# EAGLE design lymeshield_system (EAGLE 9.6.2)
APPROVED: MK; CONTACT: rluttrell@hatchpoint.com (901)605-3388; CREATED_DATE_TIME: 12/02/2022 07:42 AM; DESIGNED: RSL; FILENAME: lyme_shield_system.sch; REV: 2.3.x; SCHEMATIC_TITLE: LymeShieldSystem Main Board; SIZE: A1
Assembly variants: A

## Sheet 1 of 3: Title Page and Revisions
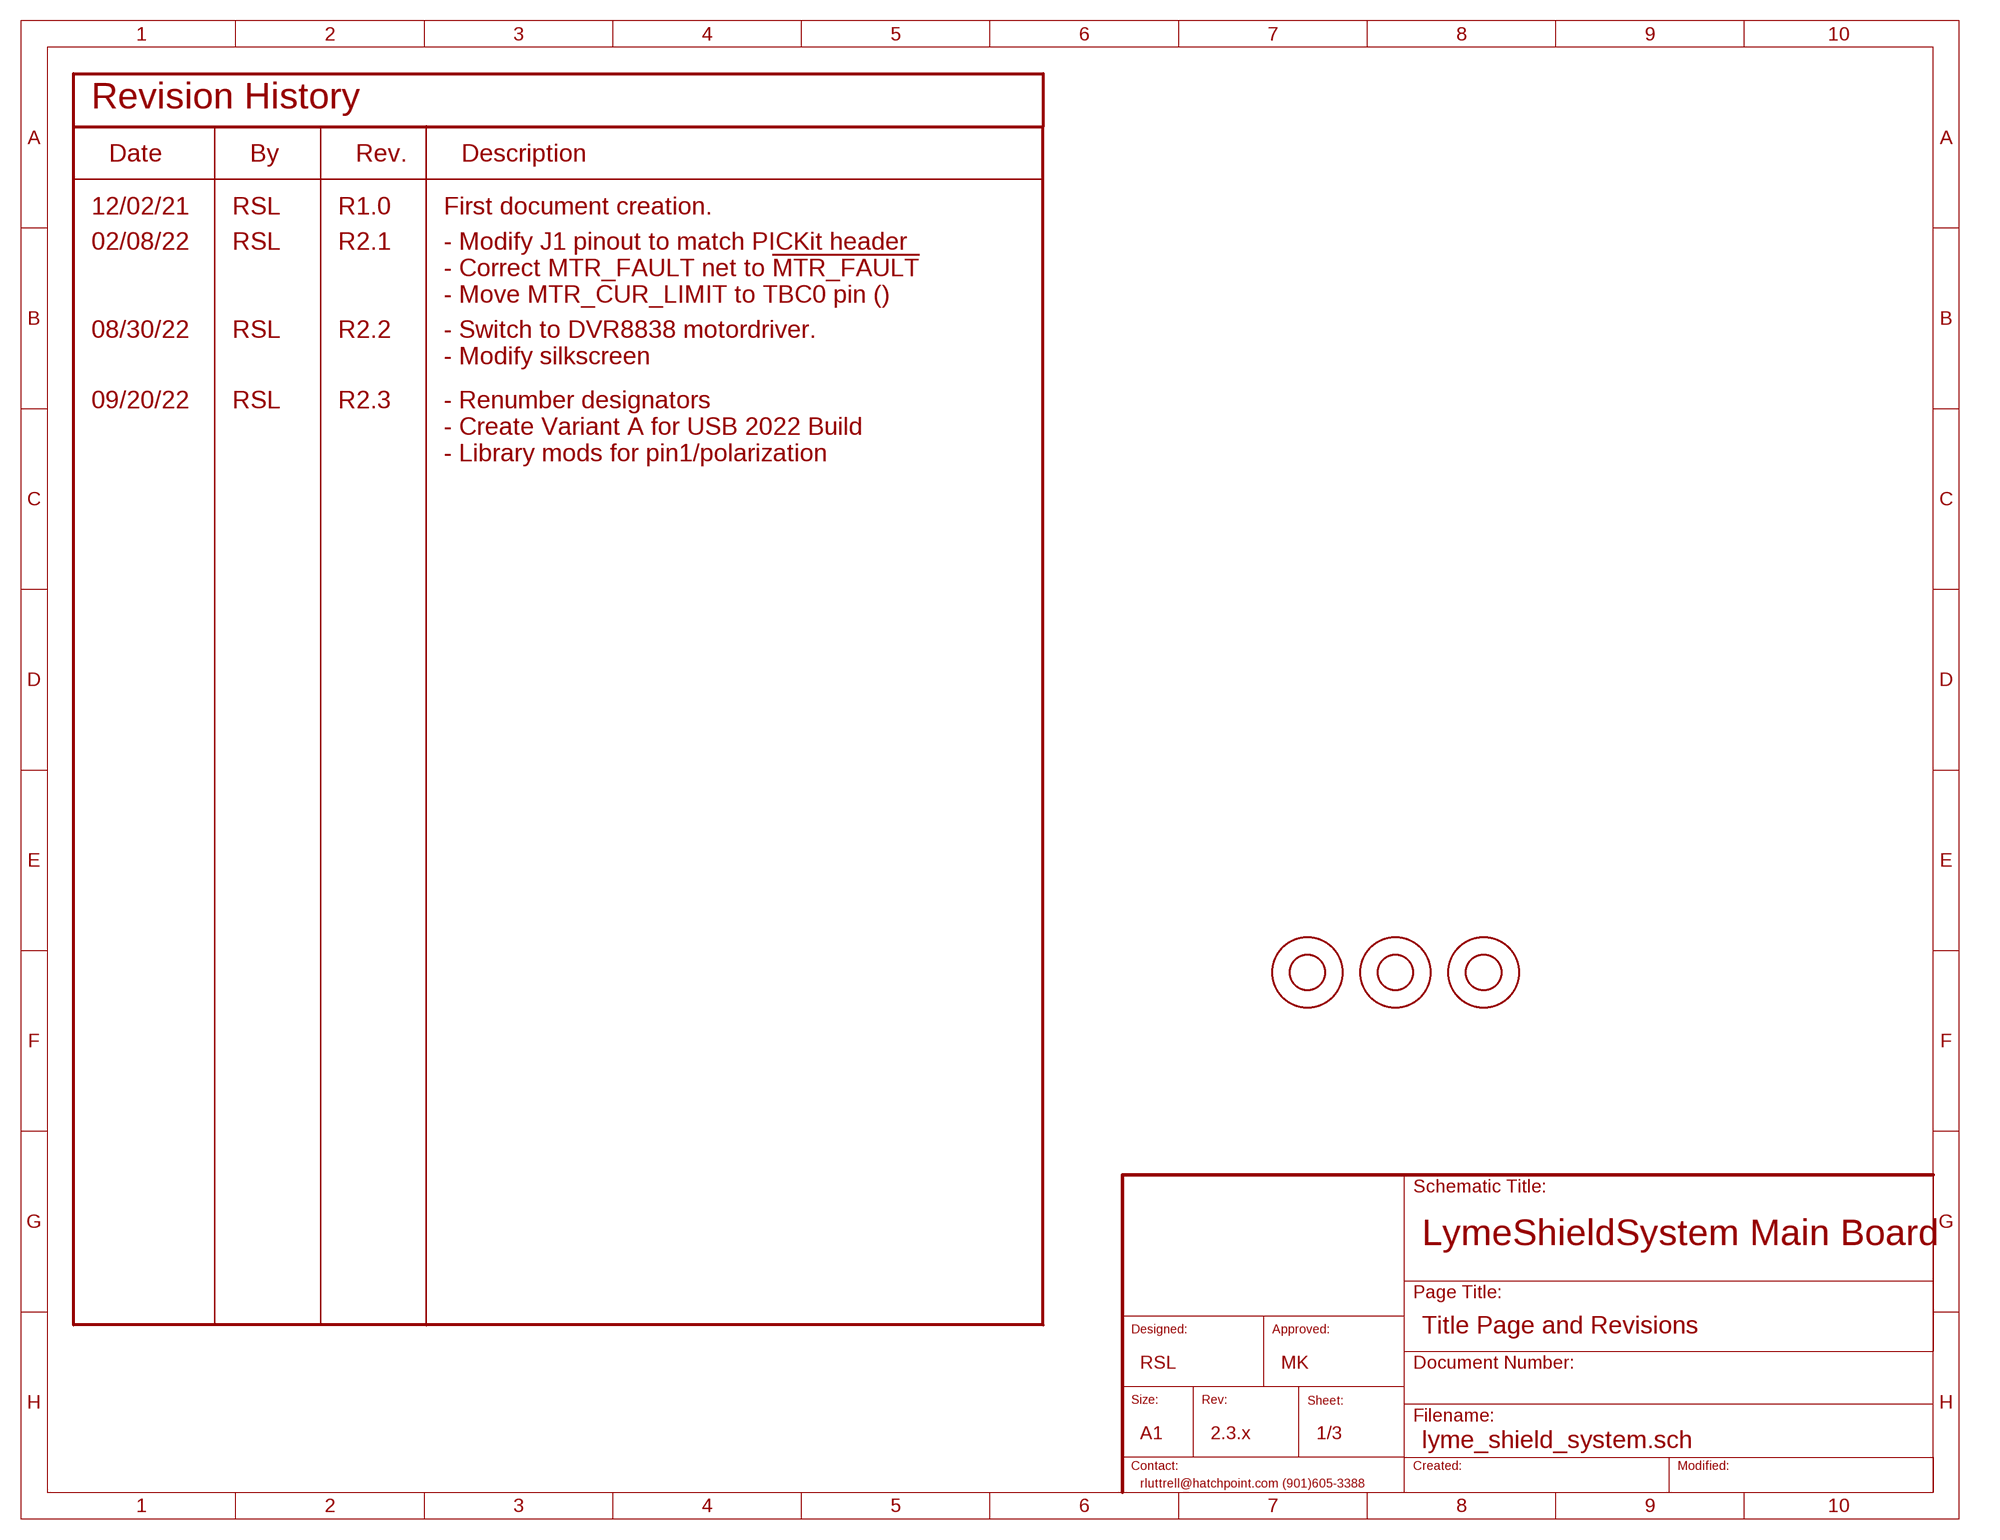
[diagram p0: schematic, sheet 1]

### Parts
FID1  FIDUCIAL_1MM_TOP_BOTTOM  [FIDUCIAL_1MM_TOP_BOTTOM]
FID2  FIDUCIAL_1MM_TOP_BOTTOM  [FIDUCIAL_1MM_TOP_BOTTOM]
FID3  FIDUCIAL_1MM_TOP_BOTTOM  [FIDUCIAL_1MM_TOP_BOTTOM]

### Notes on the sheet
- 12/02/21 | RSL | R1.0 | First document creation.
- - Modify J1 pinout to match PICKit header
  - Correct MTR_FAULT net to !MTR_FAULT
  - Move MTR_CUR_LIMIT to TBC0 pin ()
- 02/08/22 | RSL | R2.1
- - Switch to DVR8838 motordriver.
  - Modify silkscreen
- 08/30/22 | RSL | R2.2
- - Renumber designators
  - Create Variant A for USB 2022 Build
  - Library mods for pin1/polarization
- 09/20/22 | RSL | R2.3

## Sheet 2 of 3: Microcontroller and Peripherals
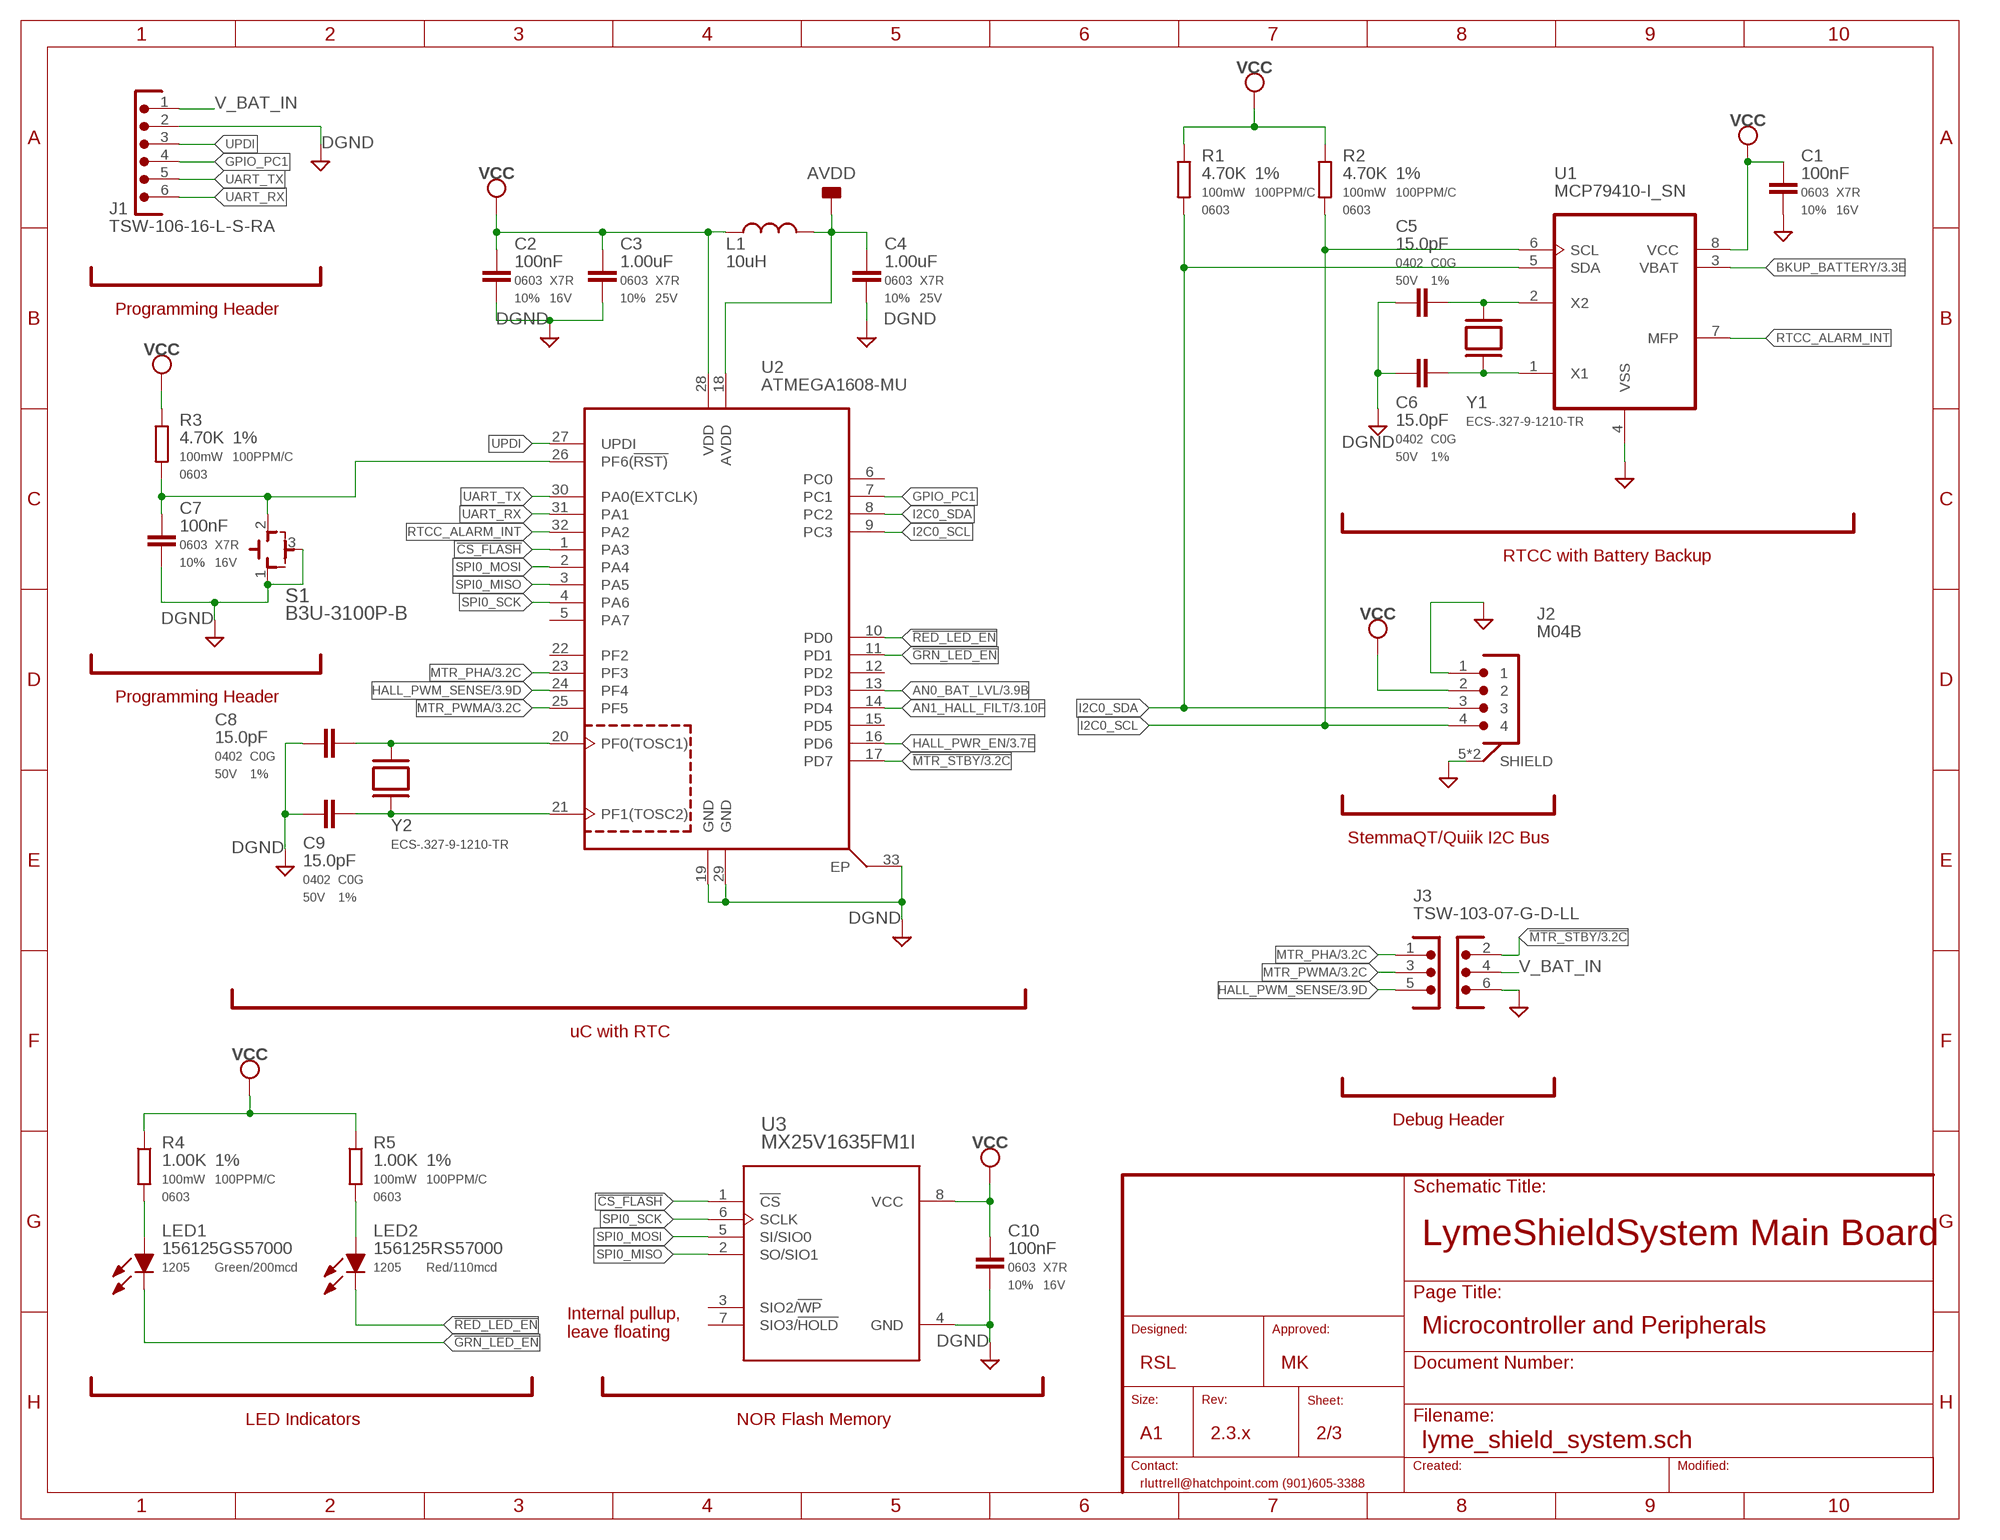
[diagram p1: schematic, sheet 2]

### Parts
C1  100nF  GCM188R71C104KA37J  [CAPC_0603_1608X90N]  (not fitted in variant A)
C2  100nF  GCM188R71C104KA37J  [CAPC_0603_1608X90N]
C3  1.00uF  GCM188R71E105KA64D  [CAPC_0603_1608X90N]
C4  1.00uF  GCM188R71E105KA64D  [CAPC_0603_1608X90N]
C5  15.0pF  GCM1555C1H150FA16D  [CAPC_0402_1005X55N]  (not fitted in variant A)
C6  15.0pF  GCM1555C1H150FA16D  [CAPC_0402_1005X55N]  (not fitted in variant A)
C7  100nF  GCM188R71C104KA37J  [CAPC_0603_1608X90N]
C8  15.0pF  GCM1555C1H150FA16D  [CAPC_0402_1005X55N]  (not fitted in variant A)
C9  15.0pF  GCM1555C1H150FA16D  [CAPC_0402_1005X55N]  (not fitted in variant A)
C10  100nF  GCM188R71C104KA37J  [CAPC_0603_1608X90N]  (not fitted in variant A)
J1  TSW-106-16-L-S-RA  [HDR-100MIL-1X6-THRU-RA]  (not fitted in variant A)
J2  M04B  [SM04B-SRSS-TB(LFSN)]  (not fitted in variant A)
J3  TSW-103-07-G-D-LL  [HDRV6W64P254_2X3_762X495X838P]  (not fitted in variant A)
L1  10uH  LB1608T100M  [INDC1608X90N]
LED1  156125GS57000  [LEDC3212X120N]  (not fitted in variant A)
LED2  156125RS57000  [LEDC3212X120N]
R1  4.70K  CRCW06034K70FKEA  [R0603K]  (not fitted in variant A)
R2  4.70K  CRCW06034K70FKEA  [R0603K]  (not fitted in variant A)
R3  4.70K  CRCW06034K70FKEA  [R0603K]
R4  1.00K  CRCW06031K00FKEAC  [R0603K]  (not fitted in variant A)
R5  1.00K  CRCW06031K00FKEAC  [R0603K]
S1  B3U-3100P-B  [B3U-3100P-B]  (not fitted in variant A)
U1  MCP79410-I_SN  [SOIC127P600X175-8N]  (not fitted in variant A)
U2  ATMEGA1608-MU  [QFN50P500X500X90-33N]
U3  MX25V1635FM1I  [SOIC127P600X175-8N]  (not fitted in variant A)
Y1  ECS-.327-9-1210-TR  [XTAL_ECS-.327-9-1210-TR]  (not fitted in variant A)
Y2  ECS-.327-9-1210-TR  [XTAL_ECS-.327-9-1210-TR]  (not fitted in variant A)

### Nets
!CS_FLASH: U2.1(PA3) U3.1(!CS)
!GRN_LED_EN: LED1.1(K) U2.11(PD1)
!MTR_STBY: J3.2 U2.17(PD7) ; also sheet 3
!RED_LED_EN: LED2.1(K) U2.10(PD0)
!RST: C7.1 R3.2 S1.2(NO) U2.26(PF6(!RST))
AN0_BAT_LVL: U2.13(PD3) ; also sheet 3
AN1_HALL_FILT: U2.14(PD4) ; also sheet 3
AVDD: C4.1 L1.2 U2.18(AVDD)
BKUP_BATTERY: U1.3(VBAT) ; also sheet 3
DGND [pwr]: C1.2 C2.2 C3.2 C4.2 C5.2 C6.2 C7.2 C8.2 C9.2 C10.2 J1.2 J2.1 J2.5(SHIELD) J2.6(SHIELD) J3.6 S1.1(COM) S1.3(COM1) U1.4(VSS) U2.19(GND) U2.29(GND) U2.33(EP) U3.4(GND) ; also sheet 3
GPIO_PC1: J1.4 U2.7(PC1)
HALL_PWM_SENSE: J3.5 U2.24(PF4) ; also sheet 3
HALL_PWR_EN: U2.16(PD6) ; also sheet 3
I2C0_SCL: J2.4 R2.2 U1.6(SCL) U2.9(PC3)
I2C0_SDA: J2.3 R1.2 U1.5(SDA) U2.8(PC2)
MTR_PHA: J3.1 U2.23(PF3) ; also sheet 3
MTR_PWMA: J3.3 U2.25(PF5) ; also sheet 3
N$1: C8.1 U2.20(PF0(TOSC1)) Y2.1
N$2: C5.1 U1.2(X2) Y1.1
N$8: LED1.2(A) R4.2
N$9: LED2.2(A) R5.2
N$16: C9.1 U2.21(PF1(TOSC2)) Y2.2
N$17: C6.1 U1.1(X1) Y1.2
RTCC_ALARM_INT: U1.7(MFP) U2.32(PA2)
SPI0_MISO: U2.3(PA5) U3.2(SO/SIO1)
SPI0_MOSI: U2.2(PA4) U3.5(SI/SIO0)
SPI0_SCK: U2.4(PA6) U3.6(SCLK)
UART_RX: J1.6 U2.31(PA1)
UART_TX: J1.5 U2.30(PA0(EXTCLK))
UPDI: J1.3 U2.27(UPDI)
V_BAT_IN [high_current]: J1.1 J3.4 ; also sheet 3
VCC [pwr]: C1.1 C2.1 C3.1 C10.1 J2.2 L1.1 R1.1 R2.1 R3.1 R4.1 R5.1 U1.8(VCC) U2.28(VDD) U3.8(VCC) ; also sheet 3
Unconnected: U2.5(PA7) U2.6(PC0) U2.12(PD2) U2.15(PD5) U2.22(PF2) U3.3(SIO2/!WP) U3.7(SIO3/!HOLD)

### Notes on the sheet
- Programming Header
- RTCC with Battery Backup
- Programming Header
- StemmaQT/Quiik I2C Bus
- uC with RTC
- Debug Header
- Internal pullup, 
  leave floating
- LED Indicators | NOR Flash Memory

## Sheet 3 of 3: Motor Driver and Position Sensor
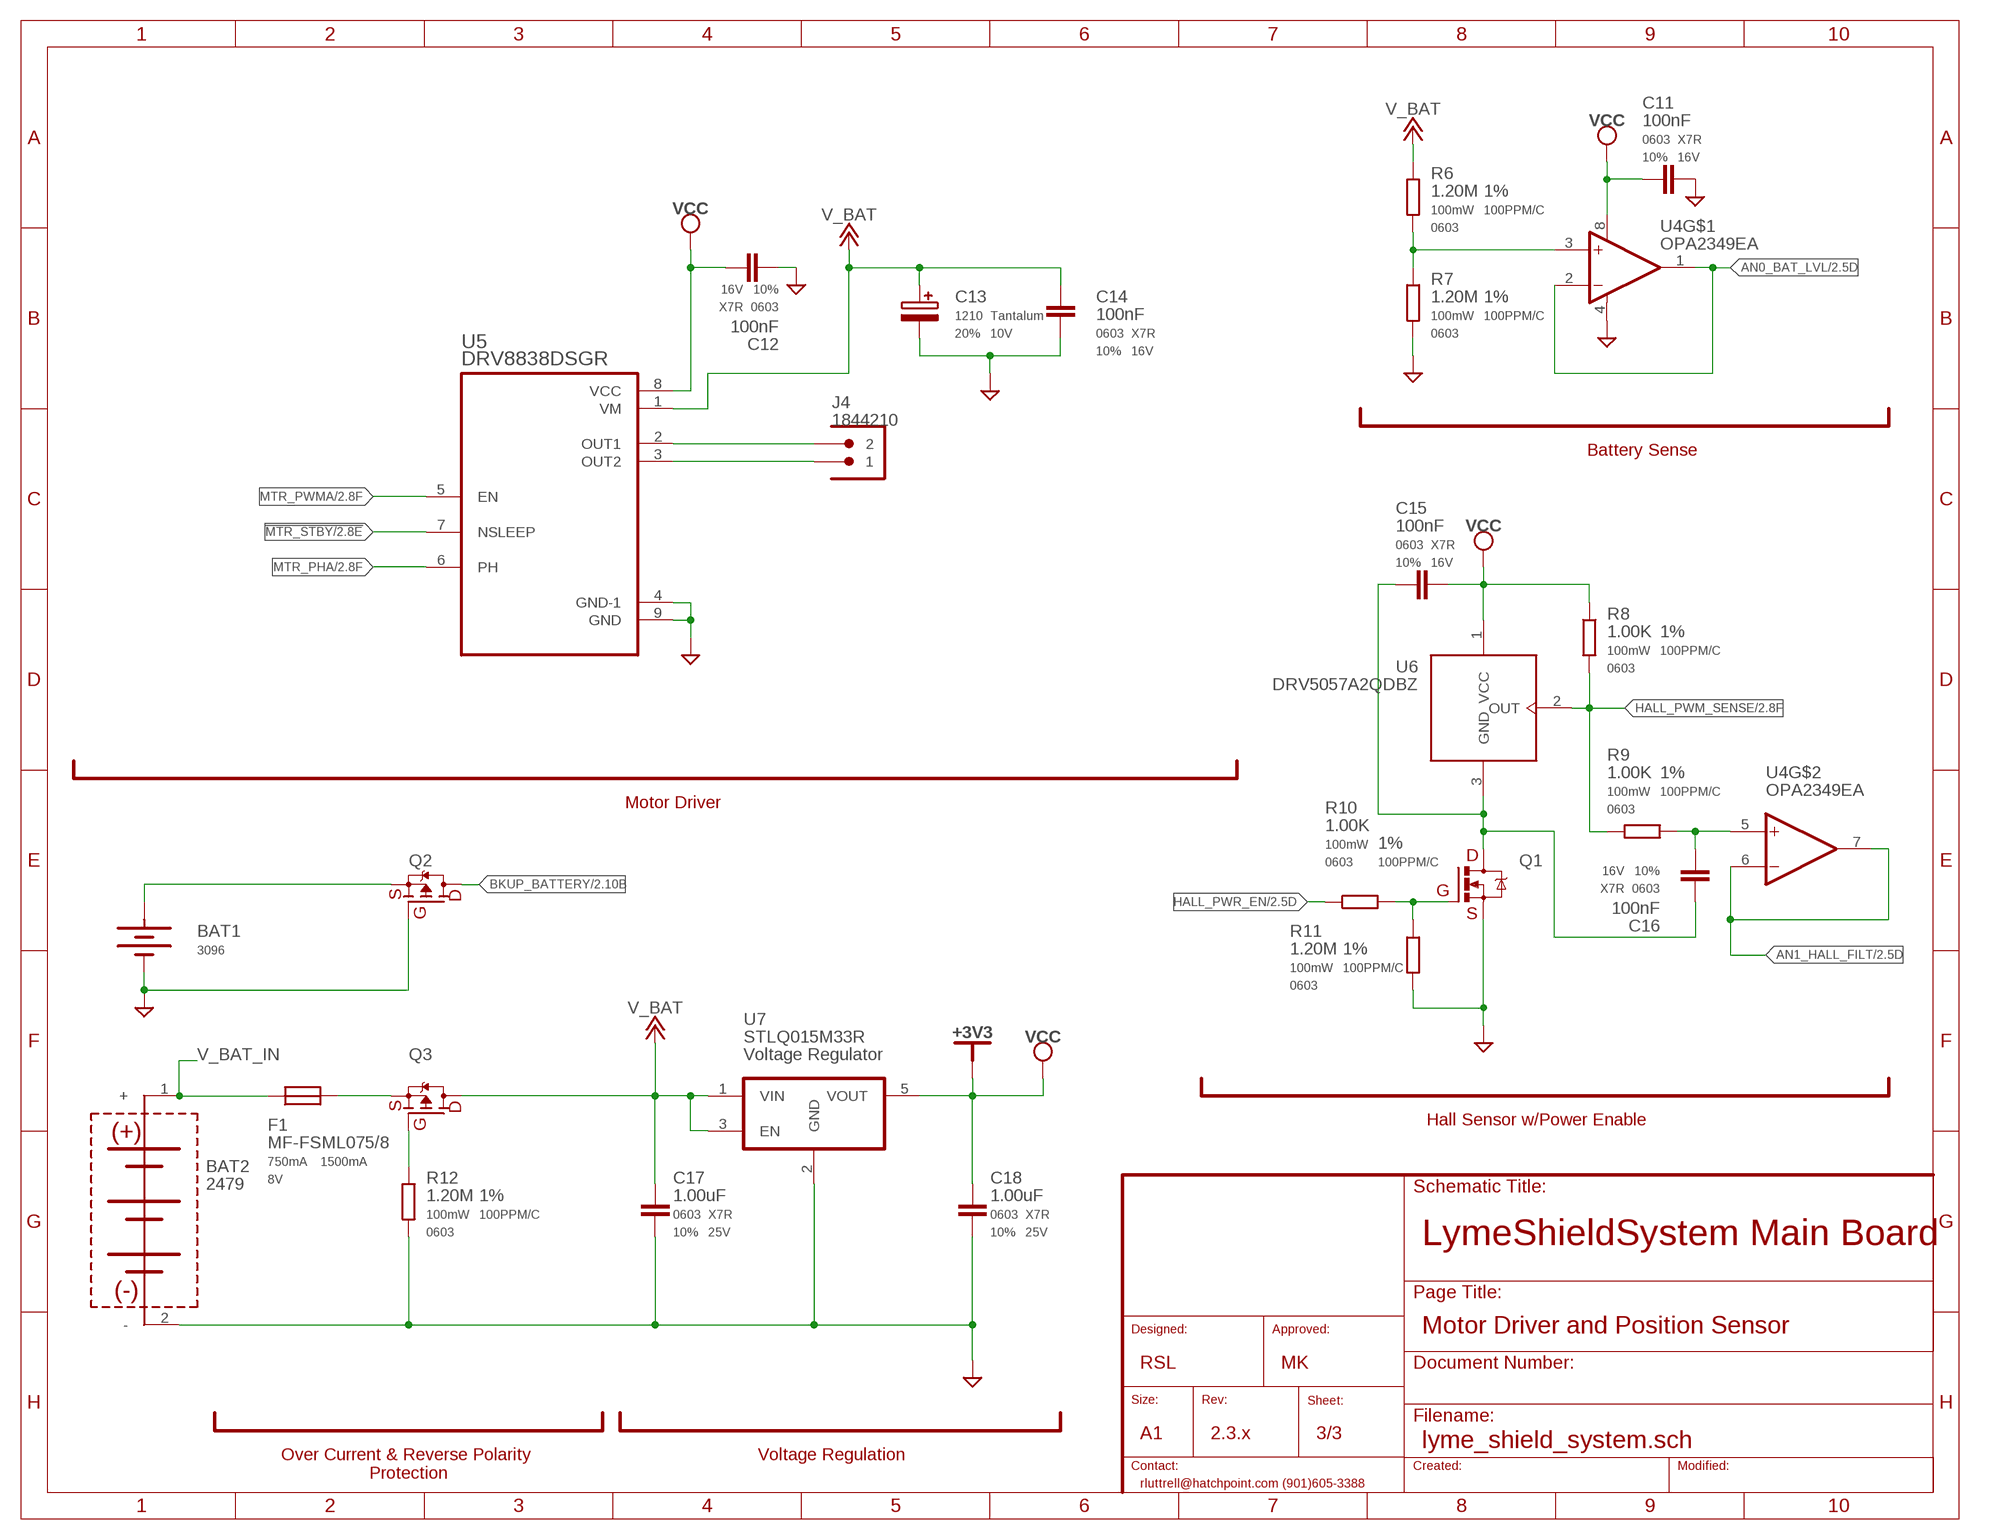
[diagram p2: schematic, sheet 3]

### Parts
BAT1  3096  [3096]  (not fitted in variant A)
BAT2  2479  [2479]
C11  100nF  GCM188R71C104KA37J  [CAPC_0603_1608X90N]
C12  100nF  GCM188R71C104KA37J  [CAPC_0603_1608X90N]
C13  TAJB226M010RNJ  [PCAPC_1210]
C14  100nF  GCM188R71C104KA37J  [CAPC_0603_1608X90N]
C15  100nF  GCM188R71C104KA37J  [CAPC_0603_1608X90N]
C16  100nF  GCM188R71C104KA37J  [CAPC_0603_1608X90N]
C17  1.00uF  GCM188R71E105KA64D  [CAPC_0603_1608X90N]
C18  1.00uF  GCM188R71E105KA64D  [CAPC_0603_1608X90N]
F1  MF-FSML075/8  [FUSC1608X70N]
J4  1844210  [1844210-2-3.50]  (not fitted in variant A)
Q1  FDN5632N-F085-FDN5632N_F085  [SOT-23]
Q2  PMOS_DMP2035U-7  [SOT-23]  (not fitted in variant A)
Q3  PMOS_DMP2035U-7  [SOT-23]
R6  1.20M  CRCW06031M20FKEA  [R0603K]
R7  1.20M  CRCW06031M20FKEA  [R0603K]
R8  1.00K  CRCW06031K00FKEAC  [R0603K]
R9  1.00K  CRCW06031K00FKEAC  [R0603K]
R10  1.00K  CRCW06031K00FKEAC  [R0603K]
R11  1.20M  CRCW06031M20FKEA  [R0603K]
R12  1.20M  CRCW06031M20FKEA  [R0603K]
U4  OPA2349EA  [SOT65P280X145-8N]
U5  DRV8838DSGR  [SON50P200X200X80-9N]
U6  DRV5057A2QDBZ  [SOT95P237X112-3N]
U7  STLQ015M33R  [SOT23-5L]

### Nets
!MTR_STBY: U5.7(NSLEEP) ; also sheet 2
AN0_BAT_LVL: U4.1(OUT) U4.2(-IN) ; also sheet 2
AN1_HALL_FILT: U4.6(-IN) U4.7(OUT) ; also sheet 2
BKUP_BATTERY: Q2.1(D) ; also sheet 2
DGND [pwr]: BAT1.1(-) BAT1.3(-) BAT2.2(-) C11.1 C12.2 C13.2(-) C14.2 C17.2 C18.2 Q1.2(S) Q2.3(G) R7.2 R11.2 R12.2 U4.4(V-) U5.4(GND-1) U5.9(GND) U7.2(GND) ; also sheet 2
HALL_PWM_SENSE: R8.2 R9.1 U6.2(OUT) ; also sheet 2
HALL_PWR_EN: R10.1 ; also sheet 2
MTR_PHA: U5.6(PH) ; also sheet 2
MTR_PWMA: U5.5(EN) ; also sheet 2
N$5: Q1.3(G) R10.2 R11.1
N$6: Q3.3(G) R12.1
N$7: BAT1.2(+) Q2.2(S)
N$10: R6.2 R7.1 U4.3(+IN)
N$14 [high_current]: F1.2 Q3.2(S)
N$20: C16.1 R9.2 U4.5(+IN)
N$23 [pwr]: C15.2 C16.2 Q1.1(D) U6.3(GND)
OUTA1 [high_current]: J4.P$2 U5.2(OUT1)
OUTA2 [high_current]: J4.P$1 U5.3(OUT2)
V_BAT [high_current]: C13.1(+) C14.1 C17.1 Q3.1(D) R6.1 U5.1(VM) U7.1(VIN) U7.3(EN)
V_BAT_IN [high_current]: BAT2.1(+) F1.1 ; also sheet 2
VCC [pwr]: C11.2 C12.1 C15.1 C18.1 R8.1 U4.8(V+) U5.8(VCC) U6.1(VCC) U7.5(VOUT) ; supply symbol labelled +3V3 ; also sheet 2

### Notes on the sheet
- Battery Sense
- Motor Driver
- Hall Sensor w/Power Enable
- Over Current & Reverse Polarity 
  Protection
- Voltage Regulation

## Library data of the parts
BAT1 = HatchPoint-Batteries:3096: Battery Contacts 2996 matte Tin Coin Cell Retainer Source: Datasheet <http://www.keyelco.com/product-pdf.cfm?p=768>; DESCRIPTION: Battery Contacts 2996 matte Tin Coin Cell Retainer; HEIGHT: 5.97mm; MANUFACTURER_NAME: Keystone Electronics; MANUFACTURER_PART_NUMBER: 3096; MOUSER_PART_NUMBER: 534-3096; MOUSER_PRICE-STOCK: https://www.mouser.co.uk/ProductDetail/Keystone-Electronics/3096?qs=BMR1h6ig6pBmf86jRreoMg%3D%3D
BAT2 = HatchPoint-Batteries:2479: KEYSTONE - 2479 - BATTERY HOLDER, AAA, 3WAY Source: Datasheet <http://www.keyelco.com/product-pdf.cfm?p=1041>; DESCRIPTION: KEYSTONE - 2479 - BATTERY HOLDER, AAA, 3WAY; HEIGHT: 13mm; MANUFACTURER_NAME: Keystone Electronics; MANUFACTURER_PART_NUMBER: 2479; MOUSER_PART_NUMBER: 534-2479; MOUSER_PRICE-STOCK: https://www.mouser.co.uk/ProductDetail/Keystone-Electronics/2479?qs=Q3RoVmURDomBPD85HfXZoA%3D%3D
C1 C2 C7 C10-C12 C14-C16 = HatchPoint-Capacitors:GCM?*: GCM Series Multilayer Ceramic Capacitors MLCC Murata; MANUFACTURER: Murata; PACKAGE: 0603; TOL: 10%; TYPE: X7R; VDC: 16V
C3 C4 C17 C18 = HatchPoint-Capacitors:GCM?*: GCM Series Multilayer Ceramic Capacitors MLCC Murata; MANUFACTURER: Murata; PACKAGE: 0603; TOL: 10%; TYPE: X7R; VDC: 25V
C5 C6 C8 C9 = HatchPoint-Capacitors:GCM?*: GCM Series Multilayer Ceramic Capacitors MLCC Murata; MANUFACTURER: Murata; PACKAGE: 0402; TOL: 1%; TYPE: C0G; VDC: 50V
C13 = HatchPoint-Capacitors:TAJ?*; DESCRIPTION: Tantalum Capcitor, 2.4Ohm ESR 1210; ESR: 2.4 Ohm; MANUFACTURER: AVX; PACKAGE: 1210; TOL: 20%; TYPE: Tantalum; VDC: 10V
F1 = HatchPoint-Bourns:MF-FSML?: Resettable Fuses - PPTC 8V 1.25A Source: Datasheet <https://www.mouser.com/datasheet/2/54/bourns_05032019_MF-FSML-X_datasheet-1591429.pdf>; DESCRIPTION: Poly Fuse; IHOLD: 750mA; ITRIP: 1500mA; VMAX: 8V
FID1-FID3 = HatchPoint:FIDUCIAL
J1 = HatchPoint-Samtec:TSW-106-16-L-S-RA
J2 = HatchPoint-JST:?M04B*: 4 way side entry SMT header,1mm pitch JST SH Series, 1mm Pitch 4 Way 1 Row Right Angle PCB Header, Solder Termination, 1A Source: Datasheet <http://docs-emea.rs-online.com/webdocs/05b0/0900766b805b098a.pdf>; DESCRIPTION: 4 way side entry SMT header,1mm pitch JST SH Series, 1mm Pitch 4 Way 1 Row Right Angle PCB Header, Solder Termination, 1A; HEIGHT: mm; MANUFACTURER_NAME: JST (JAPAN SOLDERLESS TERMINALS); MANUFACTURER_PART_NUMBER: SM04B-SRSS-TB(LFSN)
J3 = HatchPoint-Samtec:TSW-103-07-G-D-LL: CONN HEADER 6 POS .100" Source: Datasheet <http://suddendocs.samtec.com/catalog_english/tsw_th.pdf>; ARROW_PART_NUMBER: TSW-103-07-G-D-LL; ARROW_PRICE-STOCK: https://www.arrow.com/en/products/tsw-103-07-g-d-ll/samtec?region=nac; DESCRIPTION: CONN HEADER 6 POS .100"; HEIGHT: 8.38mm; MANUFACTURER_NAME: SAMTEC; MANUFACTURER_PART_NUMBER: TSW-103-07-G-D-LL; MOUSER_PART_NUMBER: 200-TSW10307GDLL; MOUSER_PRICE-STOCK: https://www.mouser.co.uk/ProductDetail/Samtec/TSW-103-07-G-D-LL?qs=rU5fayqh%252BE3VkDqz1GA%2F6A%3D%3D
J4 = HatchPoint-PhoenixContact:1844210
L1 = HatchPoint-Inductors:LB1608T100M: Ind Chip Wirewound 10uH 20% 2.52MHz Ferrite 60mA 0603 T/R Check prices <https://pricing.snapeda.com/parts/LB1608T100M/Taiyo%20Yuden/view-part?ref=eda>; AVAILABILITY: Good; DESCRIPTION: 10µH Unshielded Wirewound Inductor 60mA 700mOhm 0603 (1608 Metric); IDC: 60mA; MF: Taiyo Yuden; MP: LB1608T100M; PACKAGE: 0603; R: 700mOhm
LED1 = HatchPoint-Wurtz:156125: 3.9 V Green LED 1205 SMD, Wurth Elektronik WL-SMRD 156125GS57000 Source: Datasheet <https://docs.rs-online.com/0ef6/0900766b816634b7.pdf>; DESCRIPTION: Green/200mcd; MANUFACTURER_NAME: Wurth Electronics; PACKAGE: 1205
LED2 = HatchPoint-Wurtz:156125: 3.9 V Green LED 1205 SMD, Wurth Elektronik WL-SMRD 156125GS57000 Source: Datasheet <https://docs.rs-online.com/0ef6/0900766b816634b7.pdf>; DESCRIPTION: Red/110mcd; MANUFACTURER_NAME: Wurth Electronics; PACKAGE: 1205
Q1 = HatchPoint-Transistors:FDN5632N-F085: MOSFET Trans MOS N-Ch 60V 1.7A; DESCRIPTION: On Semi N-MOS 60V 1.7A 98mOhm MOSFET; MANUFACTURER: ON Semiconductor
Q2 Q3 = HatchPoint-Transistors:PMOS: MOSFET MOSFET P-CHANNEL SOT-23; MF: Diodes Incorporated; MP: DMP2035U-7; POPULATE: Y
R1-R12 = HatchPoint-Resistors:CRCW?*: Vishay/Dale SMD Resistor; MF: Vishay; PACKAGE: 0603; PWR_RATE: 100mW; TEMPCO: 100PPM/C; TOLERANCE: 1%; TYPE: Thick Film
S1 = HatchPoint-OMRON:B3U-3100*
U1 = HatchPoint-MicrochipTechnology:MCP79410-I_SN: I2C GP RTCC, 1Kb EE, 64B SRAM, ID Source: Datasheet <https://datasheet.datasheetarchive.com/originals/distributors/Datasheets-DGA3/278325.pdf>; ARROW_PART_NUMBER: MCP79410-I/SN; ARROW_PRICE-STOCK: https://www.arrow.com/en/products/mcp79410-isn/microchip-technology; DESCRIPTION: I2C GP RTCC, 1Kb EE, 64B SRAM, ID; HEIGHT: 1.75mm; MANUFACTURER_NAME: Microchip; MANUFACTURER_PART_NUMBER: MCP79410-I/SN; MOUSER_PART_NUMBER: 579-MCP79410-I/SN; MOUSER_PRICE-STOCK: https://www.mouser.co.uk/ProductDetail/Microchip-Technology/MCP79410-I-SN?qs=LU7oW20kJpNhp%252BQbxumdTQ%3D%3D
U2 = HatchPoint-MicrochipTechnology:ATMEGA1608: 8-bit Microcontrollers - MCU 20MHz, 16KB, SOIC Source: Datasheet <http://www.microchip.com/mymicrochip/filehandler.aspx?ddocname=en604845>; DESCRIPTION: 8-bit Microcontrollers - MCU 20MHz, 16KB, SOIC; HEIGHT: 0.9mm; MANUFACTURER_NAME: Microchip; MANUFACTURER_PART_NUMBER: ATMEGA1608-MU; MOUSER_PART_NUMBER: 556-ATMEGA1608-MU; MOUSER_PRICE-STOCK: https://www.mouser.co.uk/ProductDetail/Microchip-Technology-Atmel/ATMEGA1608-MU?qs=P1JMDcb91o6TsqFiAm0Zmw%3D%3D
U3 = HatchPoint-Macronix:MX25V*?; DENSITY: 16Mb; DESCRIPTION: Macronix 16Mb (2Mx8) NOR Flash 8-SOIC; MANUFACTURER: Macronix
U4 = HatchPoint-OPAMPs:OPA2349: 1uA, Rail-to-Rail, CMOS Operational Amplifiers Source: Datasheet <http://www.ti.com/lit/gpn/OPA2349>; ARROW_PART_NUMBER: OPA2349EA/3K; ARROW_PRICE-STOCK: https://www.arrow.com/en/products/opa2349ea3k/texas-instruments?region=nac; DESCRIPTION: 1uA, Rail-to-Rail, CMOS Operational Amplifiers; HEIGHT: 1.45mm; MANUFACTURER_NAME: Texas Instruments; MANUFACTURER_PART_NUMBER: OPA2349EA/3K; MOUSER_PART_NUMBER: 595-OPA2349EA/3K; MOUSER_PRICE-STOCK: https://www.mouser.co.uk/ProductDetail/Texas-Instruments/OPA2349EA-3K?qs=7nS3%252BbEUL6sMpP9ngN4Iww%3D%3D
U5 = HatchPoint-MotionControl:DRV8838DSGR: Check availability <https://pricing.snapeda.com/parts/DRV8838DSGT/Texas%20Instruments/view-part?ref=eda>; AVAILABILITY: In Stock; DESCRIPTION: 11-V, 1.8-A H-bridge motor driver with phase/enable control; MF: Texas Instruments; MP: DRV8838DSGT; PACKAGE: WSON-8 Texas Instruments; PRICE: None; PURCHASE-URL: https://pricing.snapeda.com/search/part/DRV8838DSGT/?ref=eda
U6 = HatchPoint-TI:DRV5057: High voltage (up to 38V), linear hall effect sensor Source: Datasheet <https://www.ti.com/lit/gpn/DRV5053>
U7 = HatchPoint-ST:STLQ015M: LDO Voltage Regulators 150 mA - ultra low quiescent current linear voltage regulator; DESC: Voltage Regulator; MF: STM; MP: STLQ015M33R; VOLTAGE: 3.3V
Y1 Y2 = HatchPoint-ABRACON:ECS-.327-9-1210-TR: Crystal 2-SMD, No Lead; CL: 9.0pF; DESCRIPTION: 32.768kHz ±20ppm Crystal 9pF 90 kOhms 2-SMD, No Lead; DIGI-KEY_PART_NUMBER: XC2283CT-ND; MF: ECS Inc.; MP: ECS-.327-9-1210-TR; PACKAGE: SMD-2 ECS International; PURCHASE-URL: https://pricing.snapeda.com/search/part/ECS-.327-9-1210-TR/?ref=eda; TOL: 20ppm

## Net classes
0 default: width 0.203 mm, drill 0.356 mm, clearance 0.152 mm
1 pwr: width 0.305 mm, drill 0.356 mm, clearance 0.152 mm to class 0, clearance 0.152 mm
2 high_current: width 0.635 mm, drill 0.356 mm, clearance 0.152 mm to class 0, clearance 0.152 mm to class 1, clearance 0.152 mm

## Board
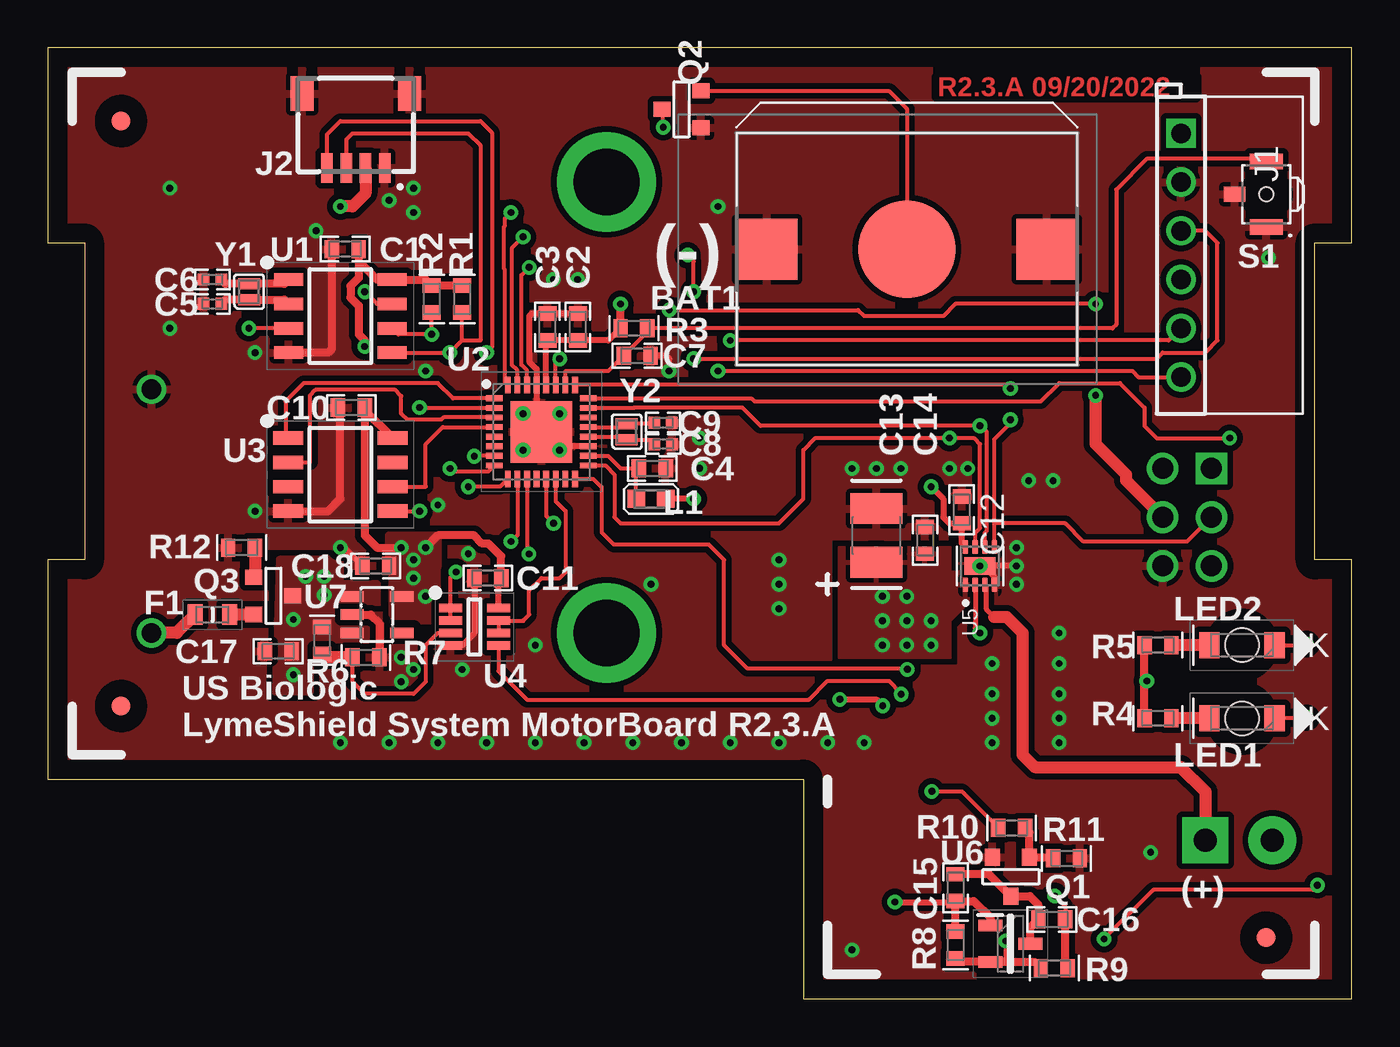
[diagram p3: board, top side]
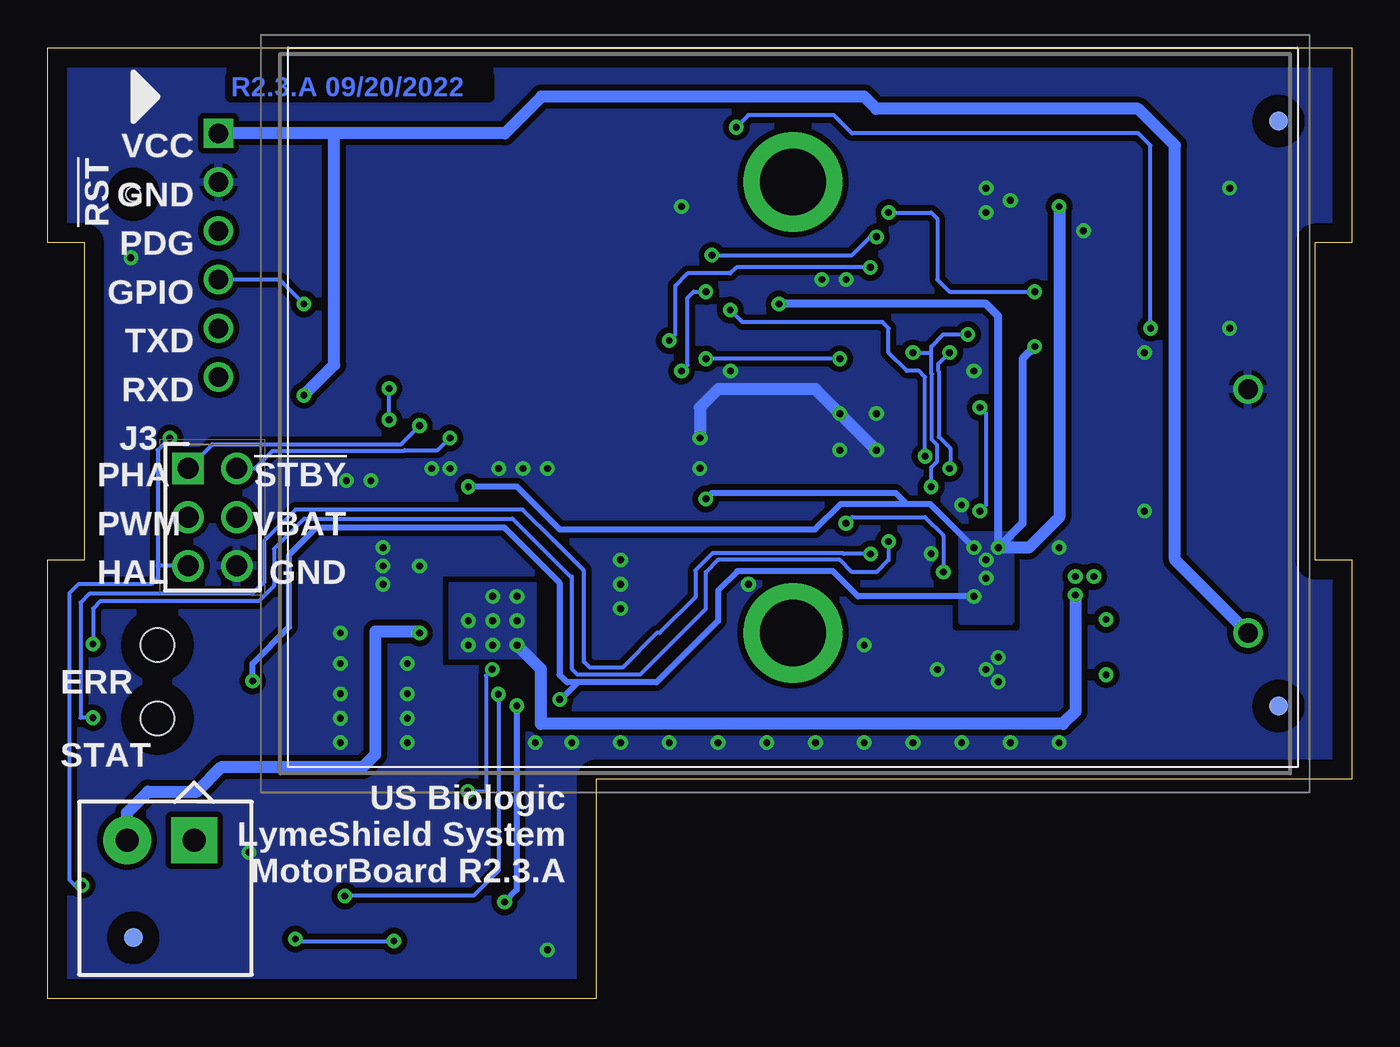
[diagram p4: board, bottom side, seen from below]

Size 67.94 x 49.53 mm. Coordinates in mm from the lower left corner, seen from the top.
Outline: 0,11.43 39.37,11.43 39.37,0 67.94,0 67.94,22.86 66.04,22.86 66.04,39.37 67.94,39.37 67.94,49.53 0,49.53 0,39.37 1.91,39.37 1.91,22.86 0,22.86 0,11.43
Copper layers (1*16): Top 0.035mm / dielectric 1.5mm / Bottom 0.035mm
Design rules "default": minimum track width 6mil, minimum drill 0.35mm, track to track 6mil, track to pad 6mil, pad to pad 6mil, via to via 6mil, smd to smd 6mil, copper to edge 40mil, drill to drill 6mil, minimum pad ring 10mil, minimum via ring 8mil, stop-mask expansion 4mil, vias tented up to drill 0mil, thermal gap 10mil

### Footprints (pad centres in the part's own frame; a part is rotated, then mirrored left to right if it is on the bottom)
3096 = smd 3.18 x 3.18: 1 -7.3,0; 3 7.3,0 | smd 5.08 x 5.08: 2 0,0
2479 = drill 1.02 pad 1.53: 1 0,0; 2 0,-12.7 | drill 3.45 pad 5.175: 3 23.72,0; 4 23.72,-23.5
CAPC_0603_1608X90N = smd 0.75 x 0.94: 1 0,0; 2 1.4,0
CAPC_0402_1005X55N = smd 0.6 x 0.62: 1 -0.46,0; 2 0.46,0
PCAPC_1210 = smd 1.6 x 2.7: 1 -1.4,0; 2 1.4,0
FUSC1608X70N = smd 0.77 x 1.07: 1 -0.9,0; 2 0.9,0
FIDUCIAL_1MM_TOP_BOTTOM = smd 1 x 1: 1 0,0 | smd 1 x 1 bottom: 2 0,0
HDR-100MIL-1X6-THRU-RA = drill 1.016 square: 1 0,0 | drill 1.016: 2 2.54,0; 3 5.08,0; 4 7.62,0; 5 10.16,0; 6 12.7,0
SM04B-SRSS-TB(LFSN) = smd 0.6 x 1.55: 1 1.5,4.661; 2 2.5,4.661; 3 3.5,4.661; 4 4.5,4.661 | smd 1.2 x 1.8: 5 0.2,0.786; 6 5.8,0.786
HDRV6W64P254_2X3_762X495X838P = drill 1.1 pad 1.65 square: 1 0,0 | drill 1.1 pad 1.65: 2 0,2.54; 3 2.54,0; 4 2.54,2.54; 5 5.08,0; 6 5.08,2.54
1844210-2-3.50 = drill 1.2 pad 2.4 square: P$1 0,0 | drill 1.2 pad 2.5: P$2 3.5,0
INDC1608X90N = smd 0.89 x 0.93: 1 -0.77,0; 2 0.77,0
LEDC3212X120N = smd 1.05 x 1.35: 1 -1.7,0; 2 1.7,0 | hole 1.753: 0,0
SOT-23 = smd 0.787 x 0.889: 1 0.025,-1.016; 2 -0.94,1.016; 3 0.991,1.016
R0603K = smd 0.75 x 0.94: 1 0,0; 2 1.4,0
B3U-3100P-B = smd 0.8 x 1.7: 1 1.7,0; 2 -1.7,0 | smd 0.8 x 1.1: 3 0,-1.65 | hole 0.75: 0,0
SOIC127P600X175-8N = smd 1.5 x 0.65: 1 -2.7,1.905; 2 -2.7,0.635; 3 -2.7,-0.635; 4 -2.7,-1.905; 5 2.7,-1.905; 6 2.7,-0.635; 7 2.7,0.635; 8 2.7,1.905
QFN50P500X500X90-33N = smd 0.85 x 0.3: 1 -2.45,1.75; 2 -2.45,1.25; 3 -2.45,0.75; 4 -2.45,0.25; 5 -2.45,-0.25; 6 -2.45,-0.75; 7 -2.45,-1.25; 8 -2.45,-1.75; 17 2.45,-1.75; 18 2.45,-1.25; 19 2.45,-0.75; 20 2.45,-0.25; 21 2.45,0.25; 22 2.45,0.75; 23 2.45,1.25; 24 2.45,1.75 | smd 0.3 x 0.85: 9 -1.75,-2.45; 10 -1.25,-2.45; 11 -0.75,-2.45; 12 -0.25,-2.45; 13 0.25,-2.45; 14 0.75,-2.45; 15 1.25,-2.45; 16 1.75,-2.45; 25 1.75,2.45; 26 1.25,2.45; 27 0.75,2.45; 28 0.25,2.45; 29 -0.25,2.45; 30 -0.75,2.45; 31 -1.25,2.45; 32 -1.75,2.45 | smd 3.2 x 3.2: 33 0,0
SOIC127P600X175-8N' = smd 1.55 x 0.7: 1 -2.725,1.905; 2 -2.725,0.635; 3 -2.725,-0.635; 4 -2.725,-1.905; 5 2.725,-1.905; 6 2.725,-0.635; 7 2.725,0.635; 8 2.725,1.905
SOT65P280X145-8N = smd 1.2 x 0.45: 1 -1.25,0.975; 2 -1.25,0.325; 3 -1.25,-0.325; 4 -1.25,-0.975; 5 1.25,-0.975; 6 1.25,-0.325; 7 1.25,0.325; 8 1.25,0.975
SON50P200X200X80-9N = smd 0.74 x 0.28: 1 -0.985,0.75; 2 -0.985,0.25; 3 -0.985,-0.25; 4 -0.985,-0.75; 5 0.985,-0.75; 6 0.985,-0.25; 7 0.985,0.25; 8 0.985,0.75 | smd 0.9 x 1.6: 9 0,0
SOT95P237X112-3N = smd 1.25 x 0.6: 1 -1.05,0.95; 2 -1.05,-0.95; 3 1.05,0
SOT23-5L = smd 0.55 x 1.2: 1 -0.95,-1.3; 2 0,-1.3; 3 0.95,-1.3; 4 0.95,1.3; 5 -0.95,1.3
XTAL_ECS-.327-9-1210-TR = smd 0.575 x 1.14: 1 -0.412,0; 2 0.412,0

### Placement (x,y rotation side)
BAT1  44.77,39.05 0 top
BAT2  5.4,19.05 180 bottom
C1  16.19,39.05 180 top
C2  27.62,34.29 90 top
C3  26.04,34.29 90 top
C4  30.8,27.62 0 top
C5  8.57,36.2 180 top
C6  8.57,37.47 180 top
C7  30,33.5 0 top
C8  32.07,28.89 0 top
C9  32.06,30 0 top
C10  16.51,30.8 180 top
C11  22.23,21.91 0 top
C12  47.62,24.77 90 top
C13  43.18,24.13 90 top
C14  45.72,23.18 90 top
C15  47.31,5.08 90 top
C16  53.02,4.13 180 top
C17  12.7,18.1 180 top
C18  17.78,22.54 180 top
F1  8.57,20 0 top
FID1  3.81,45.72 0 top
FID2  3.81,15.24 0 top
FID3  63.5,3.17 0 top
J1  59.05,45.09 270 top
J2  19.05,47.94 180 top
J3  60.64,27.62 270 bottom
J4  60.33,8.25 180 bottom
L1  31.43,26.04 180 top
LED1  62.23,14.61 180 top
LED2  62.23,18.41 180 top
Q1  50.16,6.35 0 top
Q2  33.02,46.35 270 top
Q3  11.75,20.95 90 top
R1  21.59,37.15 270 top
R2  20,37.15 270 top
R3  29.84,34.92 0 top
R4  57.15,14.61 0 top
R5  57.15,18.41 0 top
R6  14.29,19.37 270 top
R7  15.88,17.78 0 top
R8  47.31,3.49 270 top
R9  51.75,1.59 0 top
R10  49.53,8.89 0 top
R11  52.39,7.3 0 top
R12  10.79,23.49 180 top
S1  63.5,41.91 270 top
U1  15.24,35.56 0 top
U2  25.72,29.53 0 top
U3  MX25V1635FM1I  [SOIC127P600X175-8N']  15.24,27.3 0 top
U4  22.23,19.37 0 top
U5  48.58,22.54 90 top
U6  50.16,2.86 0 top
U7  17.14,20 270 top
Y1  10.48,36.83 90 top
Y2  30.16,29.53 90 top

### Tracks (layer width: path | path; a pad name or v marks a point on that pad's centre or on a via)
!CS_FLASH
  Top 0.203: U2.1 21.11,31.28 20.32,32.07 13.34,32.07 12.38,31.11 12.38,29.34 U3.1
!GRN_LED_EN  (via drill 0.36)
  Top 0.203: U2.11 24.97,23.29 25.08,23.18 v25.07,23.17 | LED1.1 63.95,14.63 v65.6,14.63
  Bottom 0.203: v65.6,14.63 66.24,14.63 66.24,20.64 65.79,21.08 57.29,21.08 56.67,21.7 56.67,23.85 55.05,25.48 43.2,25.48 41.6,23.88 | 40.01,22.31 40.01,17.55 39.7,17.24 38.01,17.24 36.2,19.05 36.06,19.05 34.2,20.91 34.2,22.32 33.3,23.22 26.52,23.22 26.47,23.17 v25.07,23.17 | 41.6,23.88 40.04,22.31 40.01,22.31 | 40.01,22.31 41.57,23.88 41.6,23.88
!MTR_STBY  (via drill 0.36)
  Top 0.203: U2.17 29.05,27.78 29.53,27.3 29.53,25.08 29.84,24.77 38.1,24.77 39.37,26.04 39.37,28.57 40.01,29.21 v46.99,29.21 48.26,29.21 48.58,28.89 48.58,24.51 48.33,24.26 U5.7
  Bottom 0.203: J3.2 57.15,27.62 56.24,28.54 49.38,28.54 49.34,28.57 47.62,28.57 v46.99,29.21
!RED_LED_EN  (via drill 0.36)
  Top 0.203: U2.10 24.47,24.15 v24.13,23.81 | LED2.1 65.54,18.41 v65.6,18.47
  Bottom 0.203: v65.6,18.47 65.6,20.32 65.21,20.71 56.97,20.71 56.17,21.51 56.17,23.43 54.59,25.01 43.73,25.01 40.72,21.99 40.65,21.99 40.65,17.19 40.34,16.88 37.09,16.88 33.66,20.32 33.66,22.23 33.02,22.86 26.67,22.86 26.04,22.23 24.77,22.23 24.13,22.86 v24.13,23.81
!RST
  Top 0.203: U2.26 26.97,32.68 26.99,32.7 29.21,32.7 C7.1 31.25,34.74 R3.2 55.49,34.92 55.68,35.11 55.68,42.15 57.27,43.75 63.36,43.75 S1.2
AN0_BAT_LVL  (via drill 0.36)
  Top 0.203: U4.2 U4.1 20.98,21.93 v21.27,22.23 | U2.13 25.97,25.15 v26.35,24.77
  Bottom 0.203: v26.35,24.77 26.04,25.08 22.23,25.08 21.27,24.13 v21.27,22.23
AN1_HALL_FILT
  Top 0.203: U4.6 U4.7 24.76,19.69 24.77,19.69 25.08,20 25.08,21.27 25.72,21.91 26.67,21.91 26.99,22.23 26.99,25.4 26.47,25.92 U2.14
AVDD
  Top 0.203: U2.18 29.19,28.28 29.84,27.62 C4.1 30.66,27.49 L1.2
BKUP_BATTERY  (via drill 0.36)
  Top 0.203: U1.3 v10.48,34.92 | v32.07,45.4 32.07,46.39 Q2.1
  Bottom 0.203: v10.48,34.92 10.48,44.45 11.11,45.09 26.04,45.09 26.99,46.04 31.43,46.04 v32.07,45.4
DGND  (via drill 0.36)
  Top 0.305: U4.4 21.58,18.39 22.23,19.04 C11.1 | C2.2 C3.2 25.21,35.69 25.08,35.56 25.08,33.19 25.47,32.8 U2.29 25.47,29.78 U2.33 | U2.19 26.87,28.78 v26.67,28.57 | C18.2 15.43,23.49 v15.24,23.49 | v32.37,32.7 32.37,33.33 32.38,33.34 32.23,33.5 C7.2 | U5.4 49.33,21.98 49.07,22.23 48.89,22.23 U5.9 v50.48,22.54
  Top 0.406: U3.4 14.61,25.4 15.24,26.04 15.24,30.67 C10.2 | U1.4 14.61,33.66 14.79,33.84 C1.2 | U7.2 16.83,20 17.27,19.55 R7.2
  Bottom 0.635: v24.77,28.57 v26.67,30.48 27.94,31.75 33.02,31.75 33.96,30.81 v33.96,29.21
  other vias: 17.78,41.59 19.05,42.23 24.77,30.48 34.92,41.27 6.35,42.23 10.79,33.66 6.35,34.92 13.97,40 10.79,25.4 21.59,17.14 18.41,17.78 18.41,16.51 19.05,17.14 57.47,7.62 33.96,27.63 49.21,17.46 19.05,40.96 63.63,38.6 48.58,22.54 31.43,21.59 25.4,18.41 21.91,23.18 41.91,2.54 19.68,32.7 20.32,25.72 15.24,13.33 17.78,13.33 20.32,13.33 22.86,13.33 25.4,13.33 27.94,13.33 30.48,13.33 33.02,13.33 35.56,13.33 38.1,13.33 40.64,13.33 42.55,13.33 49.21,15.88 52.7,15.88 52.7,17.46 49.21,14.61 52.7,14.61 52.7,19.05 49.21,13.33 52.7,13.33 46.99,27.62 43.18,27.62 47.94,27.62 50.48,21.59 41.91,27.62 44.45,27.62 50.48,23.49 26.34,37.47 27.61,37.47 38.1,22.86 38.1,21.59 38.1,20.32 51.12,26.99 52.39,26.99
  pour Top (isolate 0.305, rank 6): -3.81,52.07 69.85,52.07 69.85,-2.54 -3.81,-2.54
  pour Bottom (isolate 0.305, rank 6): -3.81,52.07 69.85,52.07 69.85,-2.54 -3.81,-2.54
GPIO_PC1  (via drill 0.36)
  Top 0.203: U2.7 22.25,28.28 v22.23,28.26 | v32.38,35.88 42.23,35.88 42.55,35.56 46.67,35.56 47.31,36.2 v54.61,36.2
  Bottom 0.203: v22.23,28.26 22.23,32.38 22.54,32.7 23.18,32.7 24.13,33.66 24.13,34.92 24.45,35.24 31.75,35.24 v32.38,35.88 | v54.61,36.2 55.88,37.47 J1.4
HALL_PWM_SENSE  (via drill 0.36)
  Top 0.203: v49.92,3 49.92,1.91 | v66.17,5.91 65.93,5.67 57.61,5.67 v55.05,3.11 | v61.59,29.21 61.58,29.19 57.8,29.19 57.15,29.84 57.15,30.8 55.88,32.07 52.7,32.07 51.75,31.11 36.83,31.11 36.67,31.28 U2.24
  Top 0.406: U6.2 51.43,1.91 R9.1 | 49.92,1.91 U6.2 | U6.2 47.49,1.91 R8.2
  Bottom 0.203: v55.05,3.11 54.94,3 v49.92,3 | v61.59,29.21 62.23,28.57 62.23,22.54 | 62.23,22.54 62.23,21.91 62.55,21.59 66.36,21.59 66.83,21.12 66.83,6.18 66.36,5.71 v66.17,5.91 | v66.17,5.91 | J3.5 62.23,22.54
HALL_PWR_EN  (via drill 0.36)
  Top 0.203: U2.16 28.42,27.08 28.85,26.64 28.85,24.3 29.5,23.66 34.45,23.66 35.24,22.86 35.24,18.41 36.47,17.19 44.79,17.19 v44.79,17.15 | R10.1 47.62,10.79 v46.07,10.79
  Bottom 0.203: v46.07,10.79 45.12,10.79 45.12,16.83 v44.79,17.15
I2C0_SCL  (via drill 0.36)
  Top 0.203: R2.2 19.91,35.65 20,35.56 v20,34.61 18.26,34.61 U1.6 | U2.9 23.56,26.67 v21.91,26.67 | J2.4 14.55,45.03 15.24,45.72 22.54,45.72 23.14,45.12 23.14,33.93 v22.86,33.66
  Bottom 0.203: 21.91,33.66 21.91,33.97 21.27,34.61 v20,34.61 | v22.86,33.66 21.91,33.66 | v21.91,26.67 21.91,27.68 21.59,27.99 21.59,28.84 21.87,29.12 21.87,32.53 21.91,32.57 21.91,33.66
I2C0_SDA  (via drill 0.36)
  Top 0.203: U1.5 v20.95,33.66 21.59,34.29 | 21.59,34.29 R1.2 | v20.95,27.62 21.12,27.46 22.95,27.46 U2.8 | 21.59,34.29 22.54,34.29 22.54,44.45 21.91,45.09 15.88,45.09 15.55,44.76 J2.3
  Bottom 0.203: v20.95,33.66 21.55,33.06 21.55,32.72 21.51,32.68 21.51,29.27 20.92,28.67 20.92,27.66 v20.95,27.62
MTR_PHA  (via drill 0.36)
  Top 0.203: U5.6 48.83,24.26 48.93,24.37 48.93,29.53 48.62,29.84 v48.58,29.84 37.15,29.84 36.2,30.8 30.56,30.8 30.54,30.78 U2.23
  Bottom 0.203: v48.58,29.84 49.53,28.89 59.37,28.89 J3.1
MTR_PWMA  (via drill 0.36)
  Top 0.203: v50.16,31.79 49.98,31.98 U2.25 | U5.5 49.33,24.77 | 49.33,24.77 49.33,29.14 50.16,29.98 v50.16,30.16 | J3.3 59.37,23.81 53.98,23.81 53.02,24.77 49.33,24.77
  Bottom 0.203: v50.16,30.16 v50.16,31.79
N$1
  Top 0.203: U2.20 30,29.28 Y2.1 31.39,29.11 C8.1
N$2
  Top 0.406: U1.2 12.32,36.42 Y1.1 9.26,36.42 C5.1
N$5
  Top 0.406: R11.1 52.32,7.37 Q1.3 51.16,8.66 R10.2
N$6
  Top 0.635: R12.1 10.79,22.01 Q3.3
N$7
  Top 0.203: Q2.2 43.83,47.3 44.77,46.35 BAT1.2
N$8
  Top 0.635: LED1.2 R4.2
N$9
  Top 0.635: LED2.2 R5.2
N$10
  Top 0.203: U4.3 20.31,19.04 19.68,18.41 19.68,16.51 19.05,15.88 16.51,15.88 15.88,16.51 R7.1
  Top 0.635: R7.1 14.47,17.78 R6.2
N$14
  Top 0.635: F1.2 9.48,20.02 Q3.2
N$16
  Top 0.203: U2.21 30,29.78 Y2.2 31.54,29.94 C9.1
N$17
  Top 0.406: U1.1 12.32,37.24 Y1.2 9.26,37.24 C6.1
N$20  (via drill 0.36)
  Top 0.203: U4.5 23.48,17.07 24.97,15.57 39.66,15.57 40.63,16.55 43.83,16.55 44.47,15.91 v44.47,15.86 | v52.48,5.35 53.02,4.8 C16.1
  Top 0.406: R9.2 53.02,1.72 C16.1
  Bottom 0.203: v44.47,15.86 44.47,6.65 45.74,5.38 52.48,5.38 v52.48,5.35
N$23
  Top 0.406: C15.2 49.04,6.48 Q1.1 51.18,5.33 51.62,4.89 C16.2 51.22,3.72 U6.3
OUTA1  (via drill 0.36)
  Top 0.254: U5.2 48.33,19.3 v48.58,19.05
  Bottom 0.635: J4.P$2 63.83,9.69 62.73,10.79 60.17,10.79 58.89,12.07 | 58.89,12.07 | 58.89,12.07 51.53,12.07 50.89,12.71 50.89,19.13 48.65,19.13 v48.58,19.05
OUTA2
  Top 0.254: U5.3 48.9,21.49 48.9,20.32 49.33,19.89
  Top 0.635: J4.P$1 60.33,10.79 59.06,12.06 51.44,12.06 50.8,12.7 50.8,19.05 49.96,19.89 49.33,19.89
RTCC_ALARM_INT  (via drill 0.36)
  Top 0.203: U2.32 23.81,32.13 23.81,37.97 23.77,38.01 23.77,40.23 23.81,40.27 23.81,40.64 v24.13,40.96 | v16.51,36.83 17.14,36.2 U1.7
  Bottom 0.203: v24.13,40.96 21.91,40.96 21.59,40.64 21.59,37.47 20.95,36.83 v16.51,36.83
SPI0_MISO
  Top 0.203: U3.2 13.65,27.94 13.65,31.43 13.93,31.71 18.1,31.71 18.41,31.39 18.41,30.48 18.73,30.16 20.5,30.16 20.61,30.28 U2.3
SPI0_MOSI  (via drill 0.36)
  Top 0.203: U3.5 v19.37,25.4 | v19.37,30.8 23.25,30.8 U2.2
  Bottom 0.203: v19.37,30.8 19.05,30.48 19.05,25.72 v19.37,25.4
SPI0_SCK
  Top 0.203: U3.6 19.68,26.67 19.68,28.89 20.57,29.78 U2.4
UART_RX  (via drill 0.36)
  Top 0.203: U2.31 24.47,32.73 24.17,33.02 24.17,39.09 v24.77,39.69 | v33.66,36.83 33.66,38.42 v33.34,38.73 | J1.6 56.83,32.38 56.52,32.7 v34.92,32.7
  Bottom 0.203: v33.66,36.83 34.29,36.83 34.61,36.51 34.61,33.02 v34.92,32.7 | v33.34,38.73 26.04,38.73 25.08,39.69 v24.77,39.69
UART_TX  (via drill 0.36)
  Top 0.203: U2.30 24.97,32.73 24.68,33.02 24.68,37.69 v25.08,38.1 | J1.5 58.42,34.29 v35.56,34.29
  Bottom 0.203: v25.08,38.1 32.07,38.1 32.38,37.78 34.61,37.78 35.24,37.15 35.24,34.61 v35.56,34.29
UPDI  (via drill 0.36)
  Top 0.203: U2.27 26.47,33.13 v26.67,33.34 | J1.3 60.33,40 60.96,39.37 60.96,34.29 60.33,33.66 58.1,33.66 57.78,33.34 v33.66,33.34
  Bottom 0.203: v26.67,33.34 v33.66,33.34
V_BAT  (via drill 0.36)
  Bottom 0.635: v14.39,21.03 14.39,14.96 15.04,14.31 42.25,14.31 42.25,17.16 v43.5,18.41
  other vias: 14.39,21.99 13.43,21.99 12.79,19.75 12.79,16.87 43.5,19.69 44.77,20.95 44.77,19.69 43.5,20.95 44.77,18.41 46.04,18.41 46.04,19.69
  pour Top (isolate 0.305, no thermals): 12.06,22.86 11.86,16.01 13.65,16.01 13.65,18.41 17.14,18.41 17.14,21.59 15.24,21.59 15.24,22.86
  pour Bottom: 42.55,17.78 42.55,21.59 46.99,21.59 46.99,17.78
  pour Top: 41.27,23.49 46.99,23.49 46.99,22.23 47.62,22.23 48.26,21.59 48.26,20.95 46.99,19.69 46.99,17.78 41.27,17.78
V_BAT_IN  (via drill 0.36)
  Top 0.635: F1.1 6.72,19.05 BAT2.1 | J3.4 56.2,26.99 56.2,27.3 54.61,28.89 v54.61,31.43
  Bottom 0.635: BAT2.1 9.21,22.86 9.21,44.45 11.11,46.35 24.77,46.35 25.4,46.99 42.23,46.99 44.13,45.09 53.02,45.09 | 53.02,45.09 J1.1 | v54.61,31.43 53.02,33.02 53.02,45.09
VCC  (via drill 0.36)
  Top 0.305: U4.8 23.48,21.76 C11.2 | U2.28 25.97,34.22 C3.1 C2.1 29.21,34.29 R3.1 | v43.51,15.26 43.18,15.59 v41.27,15.59 | v44.15,5.03 47.26,5.03 C15.1 | v33.66,26.04 L1.1 | U5.8 47.62,23.73 C12.1 46.99,24.77 46.67,25.08 46.67,26.04 v46.04,26.67
  Top 0.406: U3.8 16.51,30.66 C10.1 16.51,24.13 17.14,23.49 v18.41,23.49 | C1.1 16.19,38.42 | 16.19,38.42 17.14,37.47 U1.8 19.68,37.47 R2.1 R1.1 | U6.1 49.12,4.22 48.26,5.08 C15.1 R8.1 | v19.68,23.49 20.32,24.13 22.21,24.13 22.63,23.71 22.96,23.71 23.62,23.05 C11.2 | v16.51,33.97 16.51,34.29 16.19,34.61 16.19,36.11 15.77,36.52 15.77,37.13 16.19,37.55 16.19,38.42 | R5.1 57.15,16.68 v57.28,16.55 57.15,16.42 R4.1 | R3.1 v29.84,36.2
  Top 0.635: J2.2 16.55,41.95 15.88,41.27 v15.24,41.27
  Bottom 0.305: 19.83,20.81 v19.68,20.95 25.72,20.95 27.04,22.28 32.02,22.28 33.02,21.27 33.02,19.69 36.23,16.48 40.32,16.48 | v43.51,15.26 43.51,5.66 v44.15,5.03 | v33.66,26.04 33.34,26.35 23.76,26.35 23.18,25.77 | v19.68,23.49 21.96,25.77 23.18,25.77 | 23.18,25.77 26.64,25.77 27.96,24.45 41.27,24.45 43.5,26.67 v46.04,26.67 | v57.28,16.55 57.28,17.46 55.37,19.37 55.37,23.13 53.95,24.55 44.17,24.55 41.28,21.67 41.28,16.88 40.88,16.48 40.32,16.48 | v41.27,15.59 41.21,15.59 40.32,16.48
  Bottom 0.406: v16.51,33.97 17.14,33.34 17.14,24.77 v18.41,23.49 18.41,35.56 19.05,36.2 v29.84,36.2
  Bottom 0.635: v15.24,41.27 15.24,25.08 16.83,23.49 v18.41,23.49
  other vias: 19.05,21.91 19.05,22.86
  pour Top (isolate 0.406, rank 2, no thermals): 20.32,19.69 17.78,19.69 17.78,24.13 20.32,24.13
  pour Bottom (isolate 0.406, rank 2, no thermals): 20.32,19.69 17.78,19.69 17.78,24.13 20.32,24.13

### Text on the board
Top: R2.3.A 09/20/2022
Bottom: R2.3.A 09/20/2022
tNames: US Biologic / LymeShield System MotorBoard R2.3.A | (+)
bNames: VCC / GND / PDG / GPIO / TXD / RXD | !RST | !STBY / VBAT / GND | PHA / PWM / HAL | ERR | STAT | US Biologic / LymeShield System / MotorBoard R2.3.A